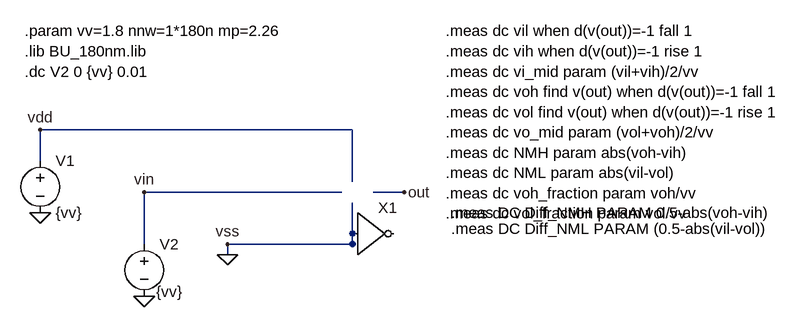
[diagram p0: schematic inv_transfer.asc]
inv_transfer.asc, the LTspice schematic file:
Version 4
SHEET 1 1168 680
WIRE 416 224 -64 224
WIRE -64 272 -64 224
WIRE 416 304 416 224
WIRE 400 320 96 320
WIRE 496 320 448 320
WIRE 96 400 96 320
WIRE 416 400 416 336
WIRE 416 400 224 400
WIRE 224 416 224 400
FLAG -64 352 0
FLAG 96 480 0
FLAG 224 416 0
FLAG -64 224 vdd
FLAG 224 400 vss
FLAG 96 320 vin
FLAG 496 320 out
SYMBOL /voltage -64 256 R0
SYMATTR InstName V1
SYMATTR Value {vv}
SYMBOL /voltage 96 384 R0
WINDOW 3 18 89 Left 2
SYMATTR Value {vv}
SYMATTR InstName V2
SYMBOL inv 416 320 R0
SYMATTR InstName X1
SYMATTR SpiceLine ll=180n wn={nnw} wp={nnw*mp}
TEXT -88 72 Left 2 !.param vv=1.8 nnw=1*180n mp=2.26\n.lib BU_180nm.lib\n.dc V2 0 {vv} 0.01
TEXT 560 72 Left 2 !.meas dc vil when d(v(out))=-1 fall 1\n.meas dc vih when d(v(out))=-1 rise 1\n.meas dc vi_mid param (vil+vih)/2/vv\n.meas dc voh find v(out) when d(v(out))=-1 fall 1\n.meas dc vol find v(out) when d(v(out))=-1 rise 1\n.meas dc vo_mid param (vol+voh)/2/vv\n.meas dc NMH param abs(voh-vih)\n.meas dc NML param abs(vil-vol)\n.meas dc voh_fraction param voh/vv\n.meas dc vol_fraction param vol/vv
TEXT 568 352 Left 2 !.meas DC Diff_NMH PARAM 0.5-abs(voh-vih)
TEXT 568 376 Left 2 !.meas DC Diff_NML PARAM (0.5-abs(vil-vol))

The netlist it stands for:
* inv_transfer.asc
V1 vdd 0 {vv}
V2 vin 0 {vv}
A§X1 0 0 0 0 0 0 0 0 BUF ll=180n wn={nnw} wp={nnw*mp}
.param vv=1.8 nnw=1*180n mp=2.26
.lib BU_180nm.lib
.dc V2 0 {vv} 0.01
.meas dc vil when d(v(out))=-1 fall 1
.meas dc vih when d(v(out))=-1 rise 1
.meas dc vi_mid param (vil+vih)/2/vv
.meas dc voh find v(out) when d(v(out))=-1 fall 1
.meas dc vol find v(out) when d(v(out))=-1 rise 1
.meas dc vo_mid param (vol+voh)/2/vv
.meas dc NMH param abs(voh-vih)
.meas dc NML param abs(vil-vol)
.meas dc voh_fraction param voh/vv
.meas dc vol_fraction param vol/vv
.meas DC Diff_NMH PARAM 0.5-abs(voh-vih)
.meas DC Diff_NML PARAM (0.5-abs(vil-vol))
.backanno
.end